# EAGLE design MB_DoorLock293 (EAGLE 9.6.2)
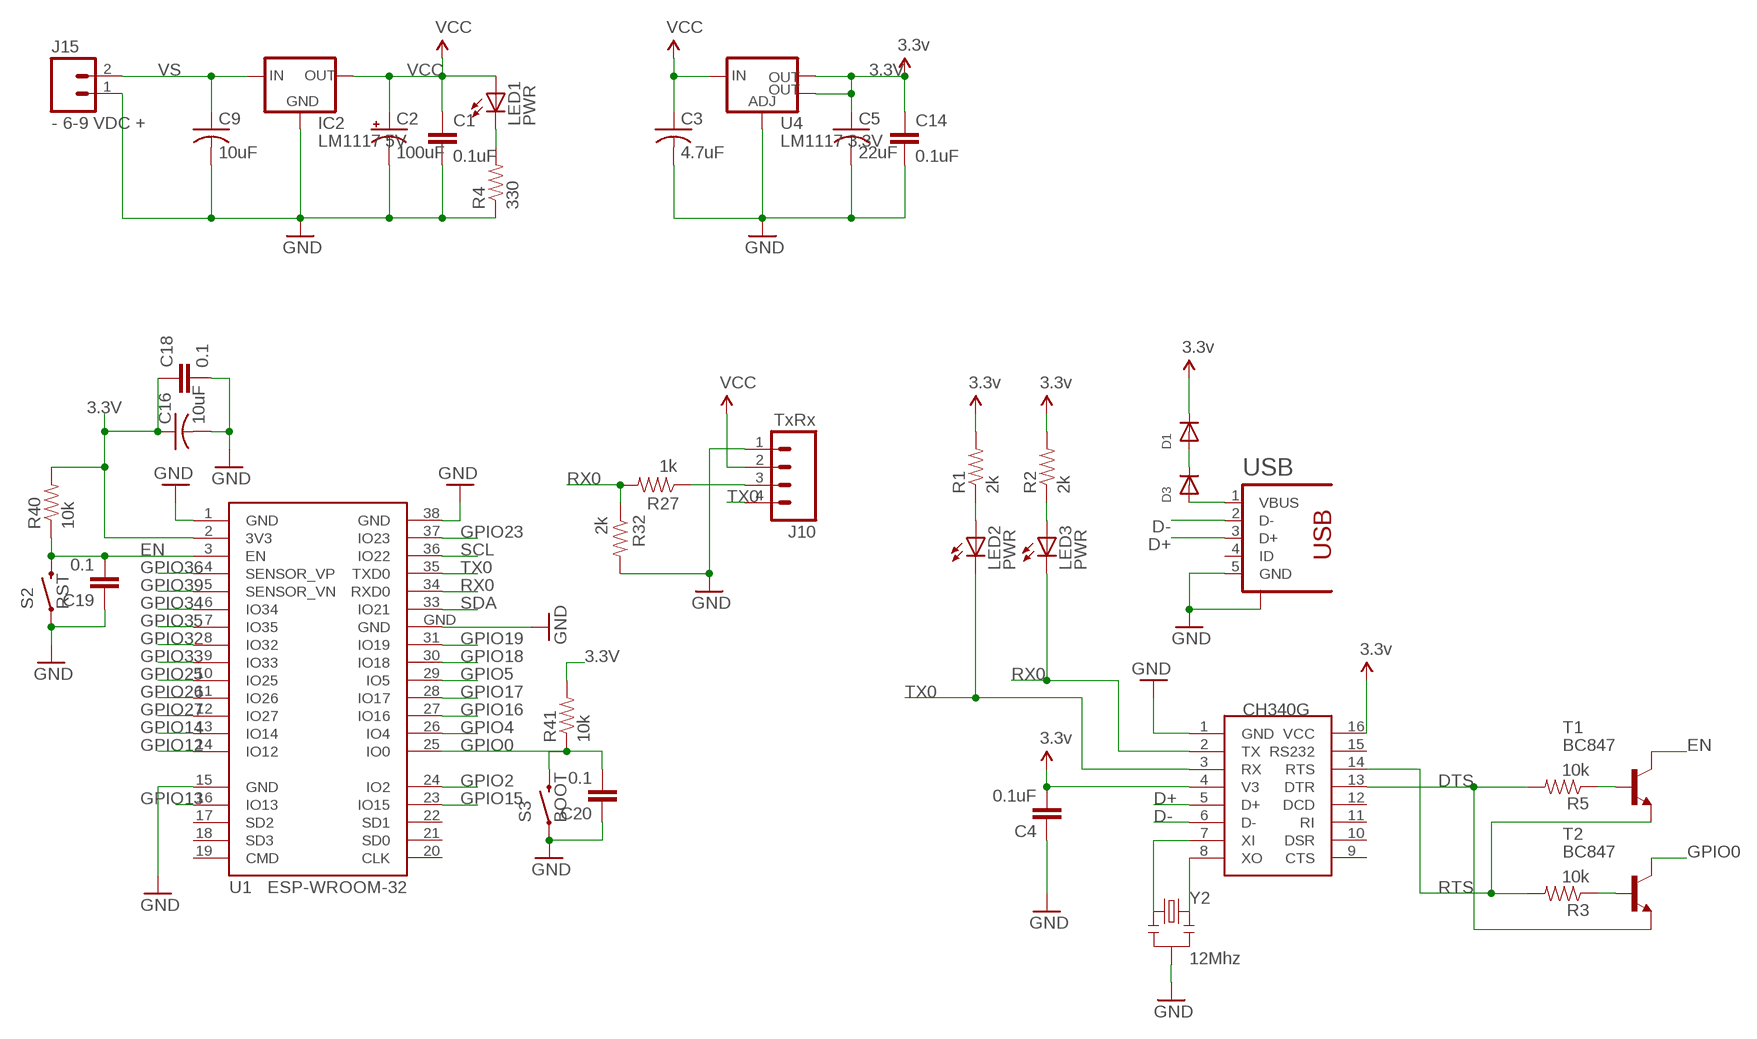
[diagram p0: schematic, sheet 1]

## Parts
C1  0.1uF  CAP0805  [0805]
C2  100uF  CAP_POL3528-KIT  [EIA3528-KIT]
C3  4.7uF  C-USC1206  [C1206]
C4  0.1uF  CAP0805  [0805]
C5  22uF  C-USC1206  [C1206]
C9  10uF  C-USC1206  [C1206]
C14  0.1uF  CAP0805  [0805]
C16  10uF  C-USC1206  [C1206]
C18  0.1  CAP0805  [0805]
C19  0.1  CAP0805  [0805]
C20  0.1  CAP0805  [0805]
D1  DIODESOD-323F  [SOD-323F]
D3  DIODESOD-323F  [SOD-323F]
IC2  LM1117 5V  LM1117DTX-3.3  [TO252]
J10  TxRx  M04POLAR  [MOLEX-1X4]
J15  - 6-9 VDC +  M02JST-PTH-VERT  [JST-2-PTH-VERT]
LED1  PWR  LEDCHIP-LED0805  [CHIP-LED0805]
LED2  PWR  LEDCHIP-LED0805  [CHIP-LED0805]
LED3  PWR  LEDCHIP-LED0805  [CHIP-LED0805]
R1  2k  RESISTOR0805-RES  [0805]
R2  2k  RESISTOR0805-RES  [0805]
R3  10k  RESISTOR0805-RES  [0805]
R4  330  RESISTOR0805-RES  [0805]
R5  10k  RESISTOR0805-RES  [0805]
R27  1k  RESISTOR0805-RES  [0805]
R32  2k  RESISTOR0805-RES  [0805]
R40  10k  RESISTOR0805-RES  [0805]
R41  10k  RESISTOR0805-RES  [0805]
S2  RST  SWITCH-MOMENTARY-2SMD-1101NE  [TACTILE-SWITCH-1101NE]
S3  BOOT  SWITCH-MOMENTARY-2SMD-1101NE  [TACTILE-SWITCH-1101NE]
T1  BC847  [SOT23]
T2  BC847  [SOT23]
U1  ESP-WROOM-32  [ESP-WROOM-32]
U4  LM1117 3.3V  V_REG_LM1117SOT223  [SOT223]
U$1  CH340G  [SOIC16]
USB  1981584-1  [1981584-1]
Y2  12Mhz  RESONATORSMD  [RESONATOR-SMD]

## Nets
3.3V: C5.1 C14.1 C16.1 C18.1 R40.2 R41.2 U1.2(3V3) U4.2(OUT) U4.4(OUT) ; supply symbol labelled 3.3v
D+: U$1.5(D+) USB.3(D+)
D-: U$1.6(D-) USB.2(D-)
DTS: R5.2 T2.2(E) U$1.13(DTR)
EN: C19.2 R40.1 S2.2 T1.3(C) U1.3(EN)
GND: C1.2 C2.C(-) C3.2 C4.1 C5.2 C9.2 C14.2 C16.2 C18.2 C19.1 C20.1 IC2.1(GND) J10.1 J15.1 R4.1 R32.2 S2.1 S3.1 U1.1(GND) U1.15(GND) U1.38(GND) U1.GND U4.1(ADJ) U$1.1(GND) USB.5(GND) USB.S1 Y2.2
GPIO0: C20.2 R41.1 S3.2 T2.3(C) U1.25(IO0)
GPIO2: U1.24(IO2)
GPIO4: U1.26(IO4)
GPIO5: U1.29(IO5)
GPIO12: U1.14(IO12)
GPIO13: U1.16(IO13)
GPIO14: U1.13(IO14)
GPIO15: U1.23(IO15)
GPIO16: U1.27(IO16)
GPIO17: U1.28(IO17)
GPIO18: U1.30(IO18)
GPIO19: U1.31(IO19)
GPIO23: U1.37(IO23)
GPIO25: U1.10(IO25)
GPIO26: U1.11(IO26)
GPIO27: U1.12(IO27)
GPIO32: U1.8(IO32)
GPIO33: U1.9(IO33)
GPIO34: U1.6(IO34)
GPIO35: U1.7(IO35)
GPIO36: U1.4(SENSOR_VP)
GPIO39: U1.5(SENSOR_VN)
N$1: LED2.A R1.1
N$2: LED3.A R2.1
N$3: D3.A USB.1(VBUS)
N$4: J10.3 R27.1
N$5: D1.A D3.C
N$6: U$1.7(XI) Y2.1
N$7: R5.1 T1.1(B)
N$8: R3.1 T2.1(B)
N$9: LED1.C R4.2
N$10: U$1.8(XO) Y2.3
RTS: R3.2 T1.2(E) U$1.14(RTS)
RX0: LED3.C R27.2 R32.1 U1.34(RXD0) U$1.2(TX)
SCL: U1.36(IO22)
SDA: U1.33(IO21)
TX0: J10.4 LED2.C U1.35(TXD0) U$1.3(RX)
VCC: C1.1 C2.A(+) C3.1 C4.2 D1.C IC2.TAB(OUT) J10.2 LED1.A R1.2 R2.2 U4.3(IN) U$1.4(V3) U$1.16(VCC) ; supply symbol labelled 3.3v
VS: C9.1 IC2.2(IN) J15.2
Unconnected: U1.17(SD2) U1.18(SD3) U1.19(CMD) U1.20(CLK) U1.21(SD0) U1.22(SD1) U$1.9(CTS) U$1.10(DSR) U$1.11(RI) U$1.12(DCD) U$1.15(RS232) USB.4(ID)

## Library data of the parts
C1 C4 C14 C18-C20 = SparkFun-Passives:CAP: Capacitor Standard 0603 ceramic capacitor, and 0.1" leaded capacitor.
C2 = SparkFun-Passives:CAP_POL: Capacitor Polarized These are standard SMD and PTH capacitors. Normally 10uF, 47uF, and 100uF in electrolytic and tantalum varieties. Always verify the external diameter of the through hole cap, it varies with capacity, voltage, and manufacturer. The EIA devices should be standard.
C3 C5 C9 C16 = adafruit:C-US: CAPACITOR, American symbol
D1 D3 = adafruit:DIODE: Diode SMADIODE - SMA Surface Mount Package 20V 1A Schottky Diode Digikey: 641-1014-6-ND DO-1N4148 - Through Hole Small Current Diode SOD-123 20V 1 A (.5mV Vf) Schottky Diode - Digikey: MBRX120TPMSCT-ND SOD-323 10V 570mA (.38mV Vf, 3ns) Schottky Diode - Digikey: ZLLS410CT-ND SOD-523 30V 30mA Schottky Diode (RB751S-40TE61) - Digikey: RB751S-40TE61CT-ND SOT23-R/W - SOT23 Package (R = Solder Paste/Reflow Ovens, W = Hand-Soldering) BAT54Film 40V 300mA - Digikey: 497-7162-1-ND
IC2 = lm1117:LM1117DTX-*
J10 = SparkFun-Connectors:M04: Header 4 Standard 4-pin 0.1" header. Use with straight break away headers (SKU : PRT-00116), right angle break away headers (PRT-00553), swiss pins (PRT-00743), machine pins (PRT-00117), and female headers (PRT-00115). Molex polarized connector foot print use with SKU : PRT-08231 with associated crimp pins and housings. 1MM SMD Version SKU: PRT-10208
J15 = SparkFun-Connectors:M02: Standard 2-pin 0.1" header. Use with - straight break away headers ( PRT-00116) - right angle break away headers (PRT-00553) - swiss pins (PRT-00743) - machine pins (PRT-00117) - female headers (PRT-00115) Molex polarized connector foot print use with: PRT-08233 with associated crimp pins and housings. 2.54_SCREWTERM for use with PRT-10571. 3.5mm Screw Terminal footprints for PRT-08084 5mm Screw Terminal footprints for use with PRT-08432
LED1-LED3 = adafruit:LED: LED OSRAM: - CHIPLED LG R971, LG N971, LY N971, LG Q971, LY Q971, LO R971, LY R971 LH N974, LH R974 LS Q976, LO Q976, LY Q976 LO Q996 - Hyper CHIPLED LW Q18S LB Q993, LB Q99A, LB R99A - SideLED LS A670, LO A670, LY A670, LG A670, LP A670 LB A673, LV A673, LT A673, LW A673 LH A674 LY A675 LS A676, LA A676, LO A676, LY A676, LW A676 LS A679, LY A679, LG A679 - Hyper Micro SIDELED® LS Y876, LA Y876, LO Y876, LY Y876 LT Y87S - SmartLED LW L88C, LW L88S LB L89C, LB L89S, LG L890 LS L89K, LO L89K, LY L89K LS L896, LA L896, LO L896, LY L896 - TOPLED LS T670, LO T670, LY T670, LG T670, LP T670 LSG T670, LSP T670, LSY T670, LOP T670, LYG T670 LG T671, LOG T671, LSG T671 LB T673, LV T673, LT T673, LW T673 LH T674 LS T676, LA T676, LO T676, LY T676, LB T676, LH T676, LSB T676, LW T676 LB T67C, LV T67C, LT T67C, LS T67K, LO T67K, LY T67K, LW E67C LS E67B, LA E67B, LO E67B, LY E67B, LB E67C, LV E67C, LT E67C LW T67C LS T679, LY T679, LG T679 LS T770, LO T770, LY T770, LG T770, LP T770 LB T773, LV T773, LT T773, LW T773 LH T774 LS E675, LA E675, LY E675, LS T675 LS T776, LA T776, LO T776, LY T776, LB T776 LHGB T686 LT T68C, LB T68C - Hyper Mini TOPLED® LB M676 - Mini TOPLED Santana® LG M470 LS M47K, LO M47K, LY M47K Source: http://www.osram.convergy.de/
R1-R5 R27 R32 R40 R41 = SparkFun-Resistors:RESISTOR: Resistor Basic schematic elements and footprints for 0603, 1206, and PTH resistors.
S2 S3 = SparkFun-Electromechanical:SWITCH-MOMENTARY-2: Various NO switches- pushbuttons, reed, etc; PROD_ID: SWCH-00815
T1 T2 = transistor:BC847: NPN TRANSISTOR
U1 = esp32:ESP-WROOM-32: Espressif Systems ESP-WROOM-32
U4 = SparkFun-PowerIC:V_REG_LM1117: Voltage Regulator LM1117 Standard adjustable voltage regulator but in SMD form. Spark Fun Electronics SKU : COM-00595; PROD_ID: VREG-08170
U$1 = ch340g:CH340G
USB = audio amplifier example:1981584-1: Receptacle, micro-USB, type A/B Tyco Electronics
Y2 = SparkFun:RESONATOR: Resonator Small SMD resonator. This is the itty bitty 10/20MHz resonators with built in caps. CSTCE10M0G55 and CSTCE20M0V53. Footprint has been reviewed closely but hasn't been tested yet.

## Board
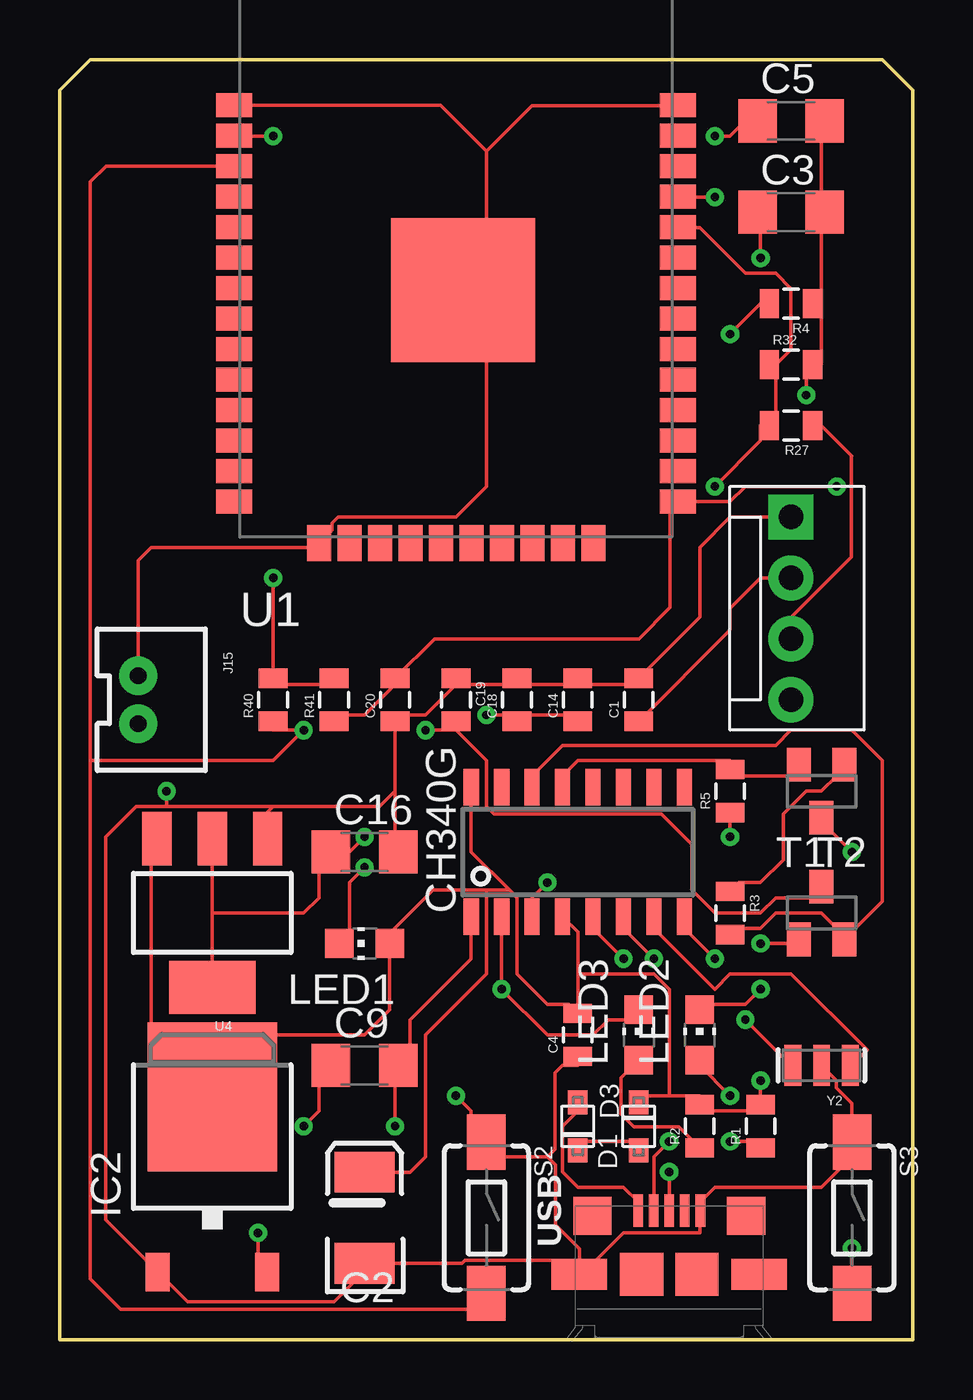
[diagram p1: board, top side]
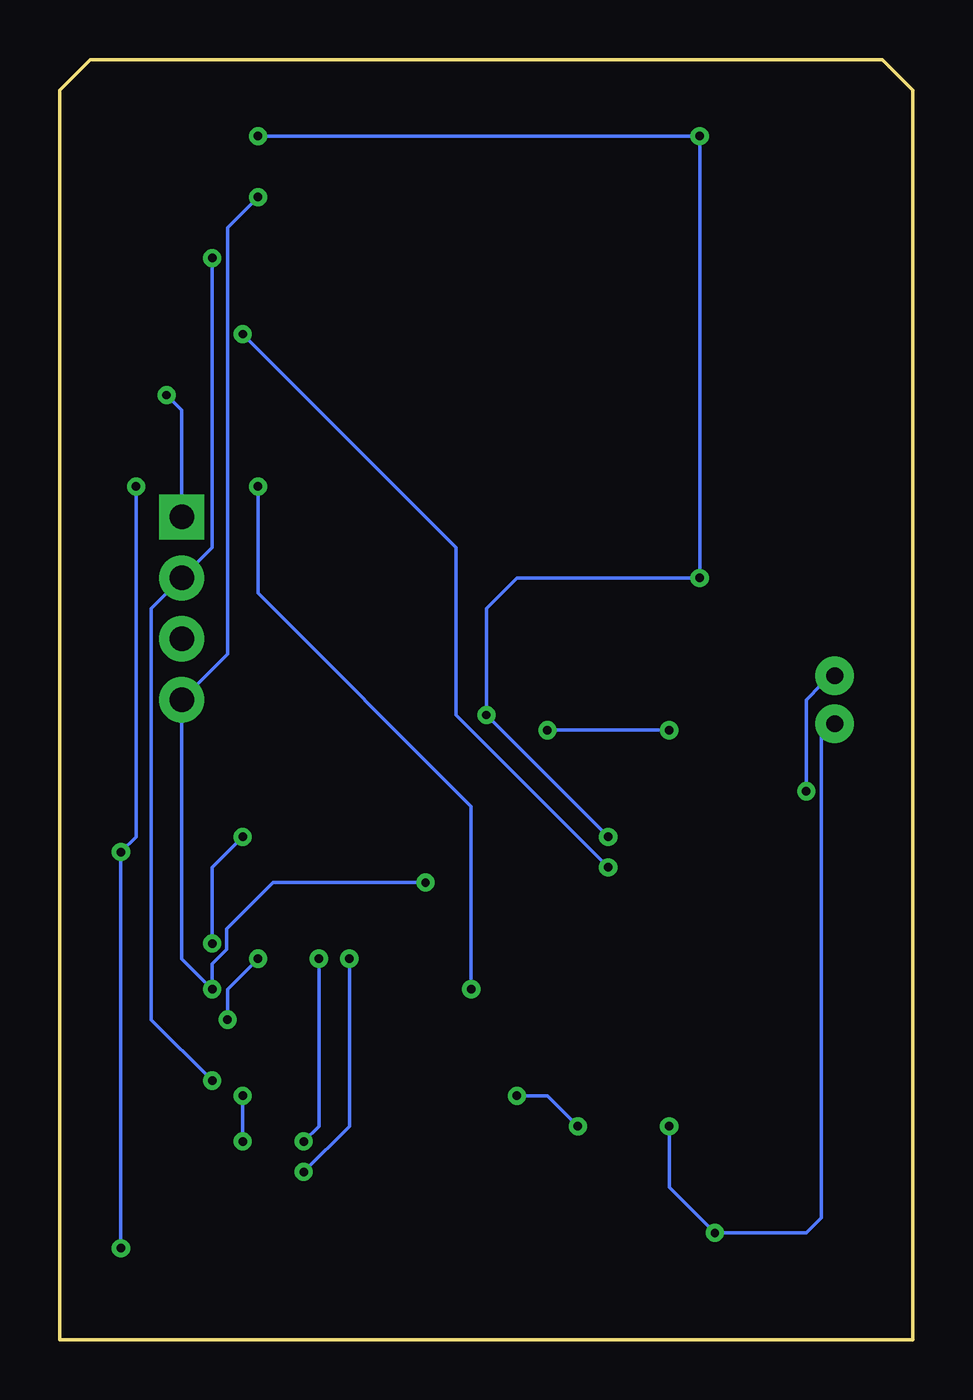
[diagram p2: board, bottom side, seen from below]

Size 35.56 x 53.34 mm. Coordinates in mm from the lower left corner, seen from the top.
Outline: 0,0 0,52.07 1.27,53.34 34.29,53.34 35.56,52.07 35.56,49.53 35.56,0 0,0
Copper layers (1*16): Top 0.035mm / dielectric 1.5mm / Bottom 0.035mm
Design rules "default": minimum track width 6mil, minimum drill 0.35mm, track to track 6mil, track to pad 6mil, pad to pad 6mil, via to via 6mil, smd to smd 6mil, copper to edge 40mil, drill to drill 6mil, minimum pad ring 10mil, minimum via ring 8mil, stop-mask expansion 4mil, vias tented up to drill 0mil, thermal gap 10mil

### Footprints (pad centres in the part's own frame; a part is rotated, then mirrored left to right if it is on the bottom)
0805 = smd 0.8 x 1.2: 1 -0.9,0; 2 0.9,0
EIA3528-KIT = smd 1.7 x 2.5: A 1.9,0; C -1.9,0
C1206 = smd 1.6 x 1.8: 1 -1.4,0; 2 1.4,0
SOD-323F = smd 1 x 0.8: A -1,0; C 1,0
TO252 = smd 1 x 1.6: 1 -2.28,-4.8; 2 2.28,-4.8 | smd 5.4 x 6.2: TAB 0,2.5
MOLEX-1X4 = drill 1.016 pad 1.88 square: 1 0,0 | drill 1.016 pad 1.88: 2 2.54,0; 3 5.08,0; 4 7.62,0
JST-2-PTH-VERT = drill 0.7 pad 1.6: 1 -1,-0.55; 2 1,-0.55
CHIP-LED0805 = smd 1.2 x 1.2: A 0,-1.05; C 0,1.05
TACTILE-SWITCH-1101NE = smd 2.3 x 1.6: 1 -3.15,0; 2 3.15,0
SOT23 = smd 1 x 1.4: 1 -0.95,-1.1; 2 0.95,-1.1; 3 0,1.1
ESP-WROOM-32 = smd 1.5 x 1: 1 -9.25,7; 2 -9.25,5.73; 3 -9.25,4.46; 4 -9.25,3.19; 5 -9.25,1.92; 6 -9.25,0.65; 7 -9.25,-0.62; 8 -9.25,-1.89; 9 -9.25,-3.16; 10 -9.25,-4.43; 11 -9.25,-5.7; 12 -9.25,-6.97; 13 -9.25,-8.24; 14 -9.25,-9.51; 25 9.25,-9.51; 26 9.25,-8.24; 27 9.25,-6.97; 28 9.25,-5.7; 29 9.25,-4.43; 30 9.25,-3.16; 31 9.25,-1.89; 32 9.25,-0.62; 33 9.25,0.65; 34 9.25,1.92; 35 9.25,3.19; 36 9.25,4.46; 37 9.25,5.73; 38 9.25,7 | smd 1 x 1.5: 15 -5.7,-11.25; 16 -4.43,-11.25; 17 -3.16,-11.25; 18 -1.89,-11.25; 19 -0.62,-11.25; 20 0.65,-11.25; 21 1.92,-11.25; 22 3.19,-11.25; 23 4.46,-11.25; 24 5.73,-11.25 | smd 6 x 6: GND 0.3,-0.7
SOT223 = smd 1.219 x 2.235: 1 -2.311,-3.099; 2 0,-3.099; 3 2.311,-3.099 | smd 3.6 x 2.2: 4 0,3.099
SOIC16 = smd 0.635 x 1.524: 1 -4.445,-2.695; 2 -3.175,-2.695; 3 -1.905,-2.695; 4 -0.635,-2.695; 5 0.635,-2.695; 6 1.905,-2.695; 7 3.175,-2.695; 8 4.445,-2.695; 9 4.445,2.695; 10 3.175,2.695; 11 1.905,2.695; 12 0.635,2.695; 13 -0.635,2.695; 14 -1.905,2.695; 15 -3.175,2.695; 16 -4.445,2.695
1981584-1 = smd 0.4 x 1.35: 1 -1.3,4.1; 2 -0.65,4.1; 3 0,4.1; 4 0.65,4.1; 5 1.3,4.1 | smd 1.8 x 1.8: M1 -1.15,1.45; M2 1.15,1.45 | smd 2.3 x 1.3: S1 -3.75,1.45; S2 3.75,1.45 | smd 1.6 x 1.6: S3 -3.2,3.885; S4 3.2,3.885
RESONATOR-SMD = smd 0.7 x 1.7: 1 -1.2,0; 2 0,0; 3 1.2,0

### Placement (x,y rotation side)
C1  24.13,26.67 90 top
C2  12.7,5.08 90 top
C3  30.48,46.99 0 top
C4  21.59,12.7 90 top
C5  30.48,50.8 0 top
C9  12.7,11.43 0 top
C14  21.59,26.67 90 top
C16  12.7,20.32 0 top
C18  19.05,26.67 90 top
C19  16.51,26.67 270 top
C20  13.97,26.67 90 top
D1  24.13,8.89 90 top
D3  21.59,8.89 270 top
IC2  6.35,7.62 0 top
J10  30.48,34.29 270 top
J15  3.81,26.67 270 top
LED1  12.7,16.51 90 top
LED2  26.67,12.7 0 top
LED3  24.13,12.7 0 top
R1  29.21,8.89 90 top
R2  26.67,8.89 90 top
R3  27.94,17.78 270 top
R4  30.48,43.18 180 top
R5  27.94,22.86 90 top
R27  30.48,38.1 180 top
R32  30.48,40.64 0 top
R40  8.89,26.67 90 top
R41  11.43,26.67 90 top
S2  17.78,5.08 270 top
S3  33.02,5.08 270 top
T1  31.75,17.78 0 top
T2  31.75,22.86 180 top
U1  16.51,44.45 0 top
U4  6.35,17.78 180 top
U$1  21.59,20.32 0 top
USB  25.4,1.27 0 top
Y2  31.75,11.43 180 top

### Tracks (layer width: path | path; a pad name or v marks a point on that pad's centre or on a via)
3.3V  (via drill 0.35)
  Top 0.152: 6.35,20.32 U4.2 6.35,17.78 | 19.05,26.04 21.59,26.04 C14.1 | R41.2 11.43,27.3 8.89,27.3 R40.2 v8.89,31.75 | v8.89,50.16 7.62,50.16 U1.2 | v27.3,50.16 27.94,50.16 28.57,50.8 C5.1 | v17.78,26.04 19.05,26.04 | 19.05,26.04 C18.1 | v12.7,20.95 12.06,20.32 C16.1 10.79,20.32 10.79,18.41 10.16,17.78 6.35,17.78 | 6.35,17.78 U4.4
  Bottom 0.152: v27.3,50.16 v8.89,50.16 8.89,34.92 v8.89,31.75 16.51,31.75 17.78,30.48 17.78,26.67 v17.78,26.04 v12.7,20.95
D+  (via drill 0.35)
  Top 0.152: v25.4,6.99 USB.3 | v23.5,15.88 22.23,17.14 U$1.5
  Bottom 0.152: v25.4,6.99 23.5,8.89 v23.5,15.88
D-  (via drill 0.35)
  Top 0.152: v25.4,8.26 24.77,7.62 24.77,5.71 USB.2 | v24.77,15.88 23.5,17.14 U$1.6
  Bottom 0.152: v25.4,8.26 24.77,8.89 v24.77,15.88
DTS
  Top 0.152: T2.2 30.48,23.5 27.94,23.5 R5.2 27.94,24.13 21.59,24.13 20.95,23.5 U$1.13
EN  (via drill 0.35)
  Top 0.152: 16.51,25.4 17.78,24.13 17.78,22.23 18.1,21.91 25.08,21.91 26.35,20.64 26.35,18.73 27.3,17.78 29.21,17.78 29.84,18.41 31.75,18.41 T1.3 | 1.27,24.13 1.27,2.54 2.54,1.27 17.12,1.27 | v15.24,25.4 16.51,25.4 | 16.51,25.4 C19.2 | R40.1 8.89,25.4 v10.16,25.4 8.89,24.13 1.27,24.13 | 17.12,1.27 17.14,1.27 | S2.2 17.12,1.27 | U1.3 1.92,48.91 1.27,48.26 1.27,24.13
  Bottom 0.152: v10.16,25.4 v15.24,25.4
GND  (via drill 0.35)
  Top 0.152: U1.15 10.79,33.02 3.81,33.02 3.26,32.47 J15.1 | 7.62,51.44 U1.1 15.86,51.45 17.78,49.53 | U1.38 25.4,51.44 19.68,51.44 17.78,49.53 | 10.79,33.66 U1.15 | 16.51,43.18 U1.GND 17.14,43.81 17.14,44.45 17.78,44.45 | C4.1 21.59,11.43 20.95,11.43 20.64,11.11 20.64,7.94 20.32,7.62 | 17.78,8.26 17.14,7.62 | 21.59,3.17 USB.S1 | USB.S1 22.23,3.17 23.5,4.45 26.67,4.45 26.67,5.08 USB.5 26.67,5.71 27.3,6.35 31.75,6.35 33.02,7.62 S3.1 33.02,9.84 32.37,10.48 32.37,10.81 Y2.2 | U$1.1 17.14,15.88 14.61,13.34 14.61,11.43 C9.2 | 4.45,3.17 IC2.1 | 13.97,11.43 C9.2 | 17.78,8.26 17.14,8.26 17.14,9.53 v16.51,10.16 | 17.78,8.26 S2.1 18.39,7.62 20.32,7.62 | 12.7,3.81 C2.C | 31.75,43.18 31.75,40.64 R32.2 31.11,40.64 v31.11,39.37 | 31.75,46.99 31.75,50.8 C5.2 | 31.75,46.99 31.75,43.18 | 31.75,43.18 R4.1 | 31.75,46.99 C3.2 | 16.51,27.3 15.24,26.04 13.97,26.04 C20.1 13.97,22.86 | 16.51,27.3 19.05,27.3 | 16.51,27.3 C19.1 | 19.05,27.3 21.59,27.3 | 19.05,27.3 C18.2 | 21.59,27.3 24.13,27.3 C1.2 26.67,30.11 26.67,33.02 27.94,34.29 J10.1 | 21.59,27.3 C14.2 | 13.97,22.86 13.97,20.32 C16.2 | 8.89,20.95 U4.1 8.66,22 8.89,22.23 | 8.89,22.23 4.45,22.23 | 4.45,22.23 3.17,22.23 1.91,20.95 1.91,4.99 IC2.1 | 4.45,22.23 v4.45,22.86 | 13.97,22.86 13.34,22.23 8.89,22.23 | 20.32,7.62 20.65,7.29 20.65,4.78 21.65,3.78 USB.S1 | C2.C 16.76,3.18 16.89,3.31 20.82,3.31 21.59,2.54 21.65,2.6 USB.S1 | IC2.1 5.32,1.57 11.43,1.57 12.7,2.85 C2.C | C9.2 13.97,11.3 v13.97,8.89 | U1.15 11.35,33.74 11.35,34.05 11.6,34.29 16.51,34.29 17.78,35.56 17.78,44.45 | 17.78,44.45 17.78,49.53
  Bottom 0.152: v31.11,39.37 30.48,38.73 J10.1 | v4.45,22.86 4.45,26.67 3.81,27.3 J15.1 | v13.97,8.89 15.24,10.16 v16.51,10.16
GPIO0  (via drill 0.35)
  Top 0.152: v33.02,20.32 31.75,21.59 T2.3 | S3.2 v33.02,3.81 | R41.1 11.43,26.04 12.7,26.04 13.97,27.3 C20.2 15.61,29.21 24.13,29.21 25.43,30.51 25.43,34.93 U1.25 26.04,34.92 27.94,34.92 28.57,35.56 v32.38,35.56
  Bottom 0.152: v33.02,3.81 v33.02,20.32 32.38,20.95 v32.38,35.56
N$1  (via drill 0.35)
  Top 0.152: v27.94,8.26 29.21,8.26 R1.1 | v27.94,10.16 26.67,11.43 LED2.A
  Bottom 0.152: v27.94,10.16 v27.94,8.26
N$2
  Top 0.152: R2.1 25.8,8.86 23.93,8.86 23.38,9.41 23.38,10.9 LED3.A
N$3
  Top 0.152: D3.A 21.59,9.53 20.95,8.89 20.95,6.99 21.59,6.35 23.5,6.35 24.13,5.71 USB.1
N$4
  Top 0.152: R27.1 31.75,38.1 33.02,36.83 32.99,36.8 32.99,32.61 30.48,30.1 J10.3
N$5
  Top 0.152: D3.C 21.59,8.26 24.13,8.26 D1.A
N$6
  Top 0.152: U$1.7 24.77,17.14 27.3,14.61 27.94,15.24 30.48,15.24 33.66,12.06 33.02,11.43 Y2.1
N$7  (via drill 0.35)
  Top 0.152: v27.94,20.95 R5.1 | v29.21,16.51 30.48,16.51 T1.1
  Bottom 0.152: v27.94,20.95 29.21,19.68 v29.21,16.51
N$8
  Top 0.152: T2.1 32.38,23.5 31.75,22.86 31.11,22.86 30.16,21.91 30.16,20 29.21,19.05 28.31,19.05 R3.1
N$9  (via drill 0.35)
  Top 0.152: v12.7,19.68 12.06,19.05 12.06,16.51 LED1.C | v27.94,41.91 29.21,43.18 R4.2
  Bottom 0.152: v12.7,19.68 19.05,26.04 19.05,33.02 v27.94,41.91
N$10  (via drill 0.35)
  Top 0.152: v27.3,15.88 26.04,17.14 U$1.8 | v28.57,13.34 30.48,11.43 Y2.3
  Bottom 0.152: v27.3,15.88 28.57,14.61 v28.57,13.34
RTS
  Top 0.152: R3.2 27.94,17.14 29.21,17.14 29.84,17.78 31.75,17.78 32.38,17.14 T1.2 34.29,18.27 34.29,24.13 33.02,25.4 30.48,25.4 29.84,24.77 20.95,24.77 19.68,23.5 U$1.14
RX0  (via drill 0.35)
  Top 0.152: 29.84,40.64 29.84,38.1 R27.2 29.21,38.1 29.21,37.47 v27.3,35.56 | 29.84,40.64 30.48,41.27 30.48,43.81 29.84,44.45 28.57,44.45 26.67,46.35 26.04,46.35 U1.34 | 29.84,40.64 R32.1 | 18.41,16.51 U$1.2 v18.41,14.61 20.32,12.7 22.23,12.7 22.86,13.34 24.13,13.34 LED3.C
  Bottom 0.152: v18.41,14.61 18.41,22.23 27.3,31.11 v27.3,35.56
TX0  (via drill 0.35)
  Top 0.152: v29.21,14.61 28.57,13.97 26.67,13.97 LED2.C | v27.3,47.62 26.04,47.62 U1.35 | U$1.3 19.68,18.41 v20.32,19.05
  Bottom 0.152: v27.3,47.62 28.57,46.35 28.57,28.57 29.21,27.94 J10.4 30.48,15.88 v29.21,14.61 29.21,15.65 28.6,16.26 28.6,17.12 26.67,19.05 v20.32,19.05
VCC  (via drill 0.35)
  Top 0.152: v29.21,45.09 29.21,46.99 C3.1 | 25.4,10.16 26.67,10.16 R2.2 26.67,9.53 29.21,9.53 R1.2 v29.21,10.79 | 25.4,10.16 24.13,10.16 D1.C | 20.95,17.14 U$1.4 21.59,16.99 21.59,15.24 | 13.34,6.99 C2.A 14.6,6.98 15.24,7.62 15.24,12.7 17.78,15.24 17.78,18.73 | 25.4,10.16 25.4,14.61 24.77,15.24 21.59,15.24 | 21.59,13.97 C4.2 | U$1.16 17.14,20.32 18.73,18.73 | U4.3 3.81,20.32 3.81,12.7 6.35,10.16 IC2.TAB 8.93,12.7 12.7,12.7 13.75,13.75 LED1.A | 18.73,18.73 19.05,18.41 19.05,15.24 20.32,13.97 21.22,13.97 C4.2 | C1.1 27.94,29.58 27.94,30.48 29.21,31.75 J10.2 | LED1.A 13.97,16.73 | 18.73,18.73 17.78,18.73 | 17.78,18.73 15.56,18.73 13.75,16.93 LED1.A | C4.2 21.59,15.24
  Bottom 0.152: v29.21,45.09 29.21,33.02 J10.2 31.75,30.48 31.75,13.34 v29.21,10.79
VS  (via drill 0.35)
  Top 0.152: v8.26,4.45 8.26,3.17 IC2.2 | v10.16,8.89 10.79,9.53 10.79,11.43 C9.1
  Bottom 0.152: J15.2 3.81,25.4 3.81,5.08 4.45,4.45 v8.26,4.45 10.16,6.35 v10.16,8.89